# EAGLE board GECBalloonMCUFlightBoard_REV2.0_5-6-19 (EAGLE 7.6.0), part 1 of 2
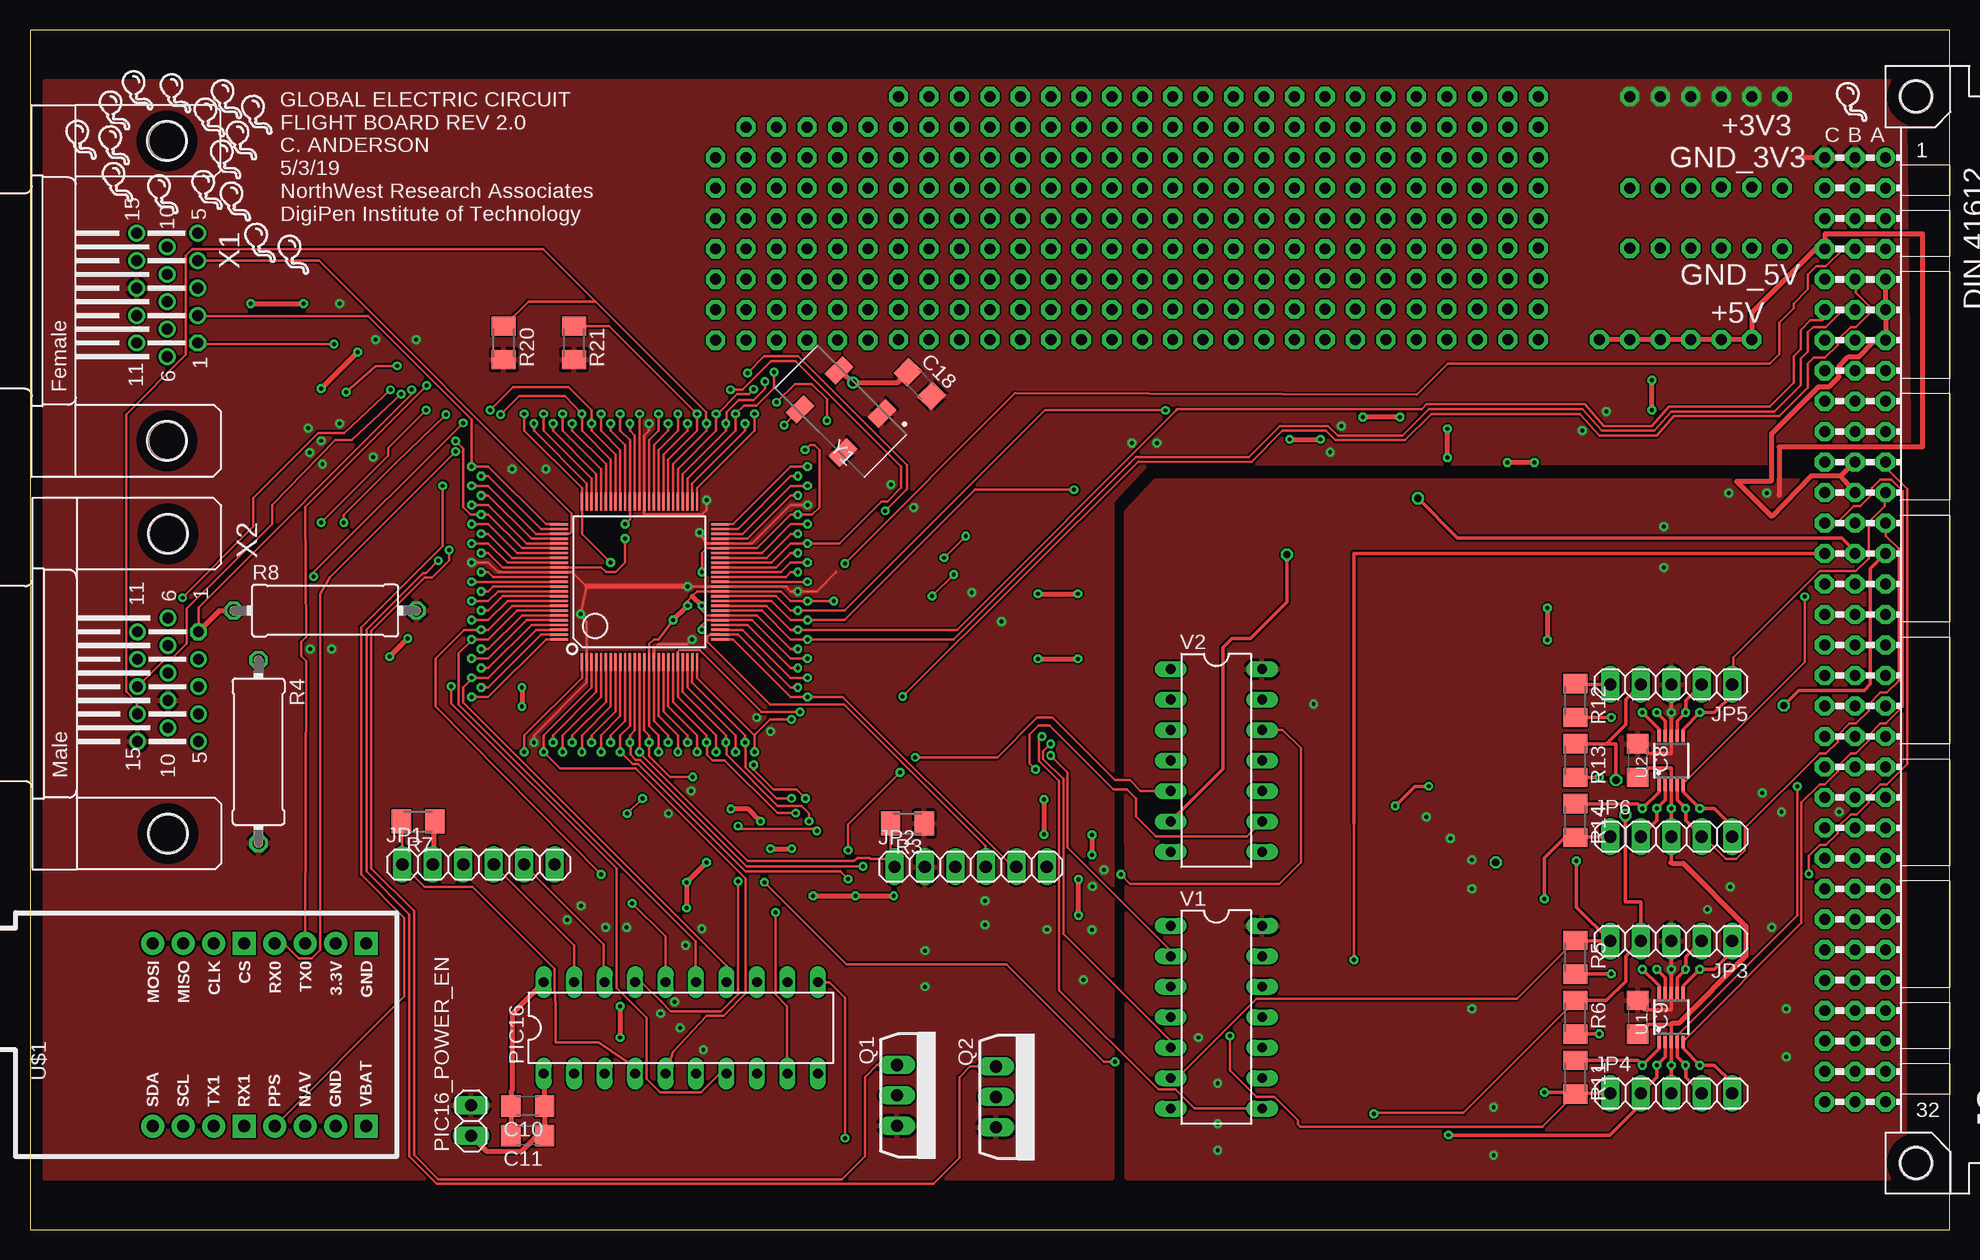
[diagram p2: board, top side]
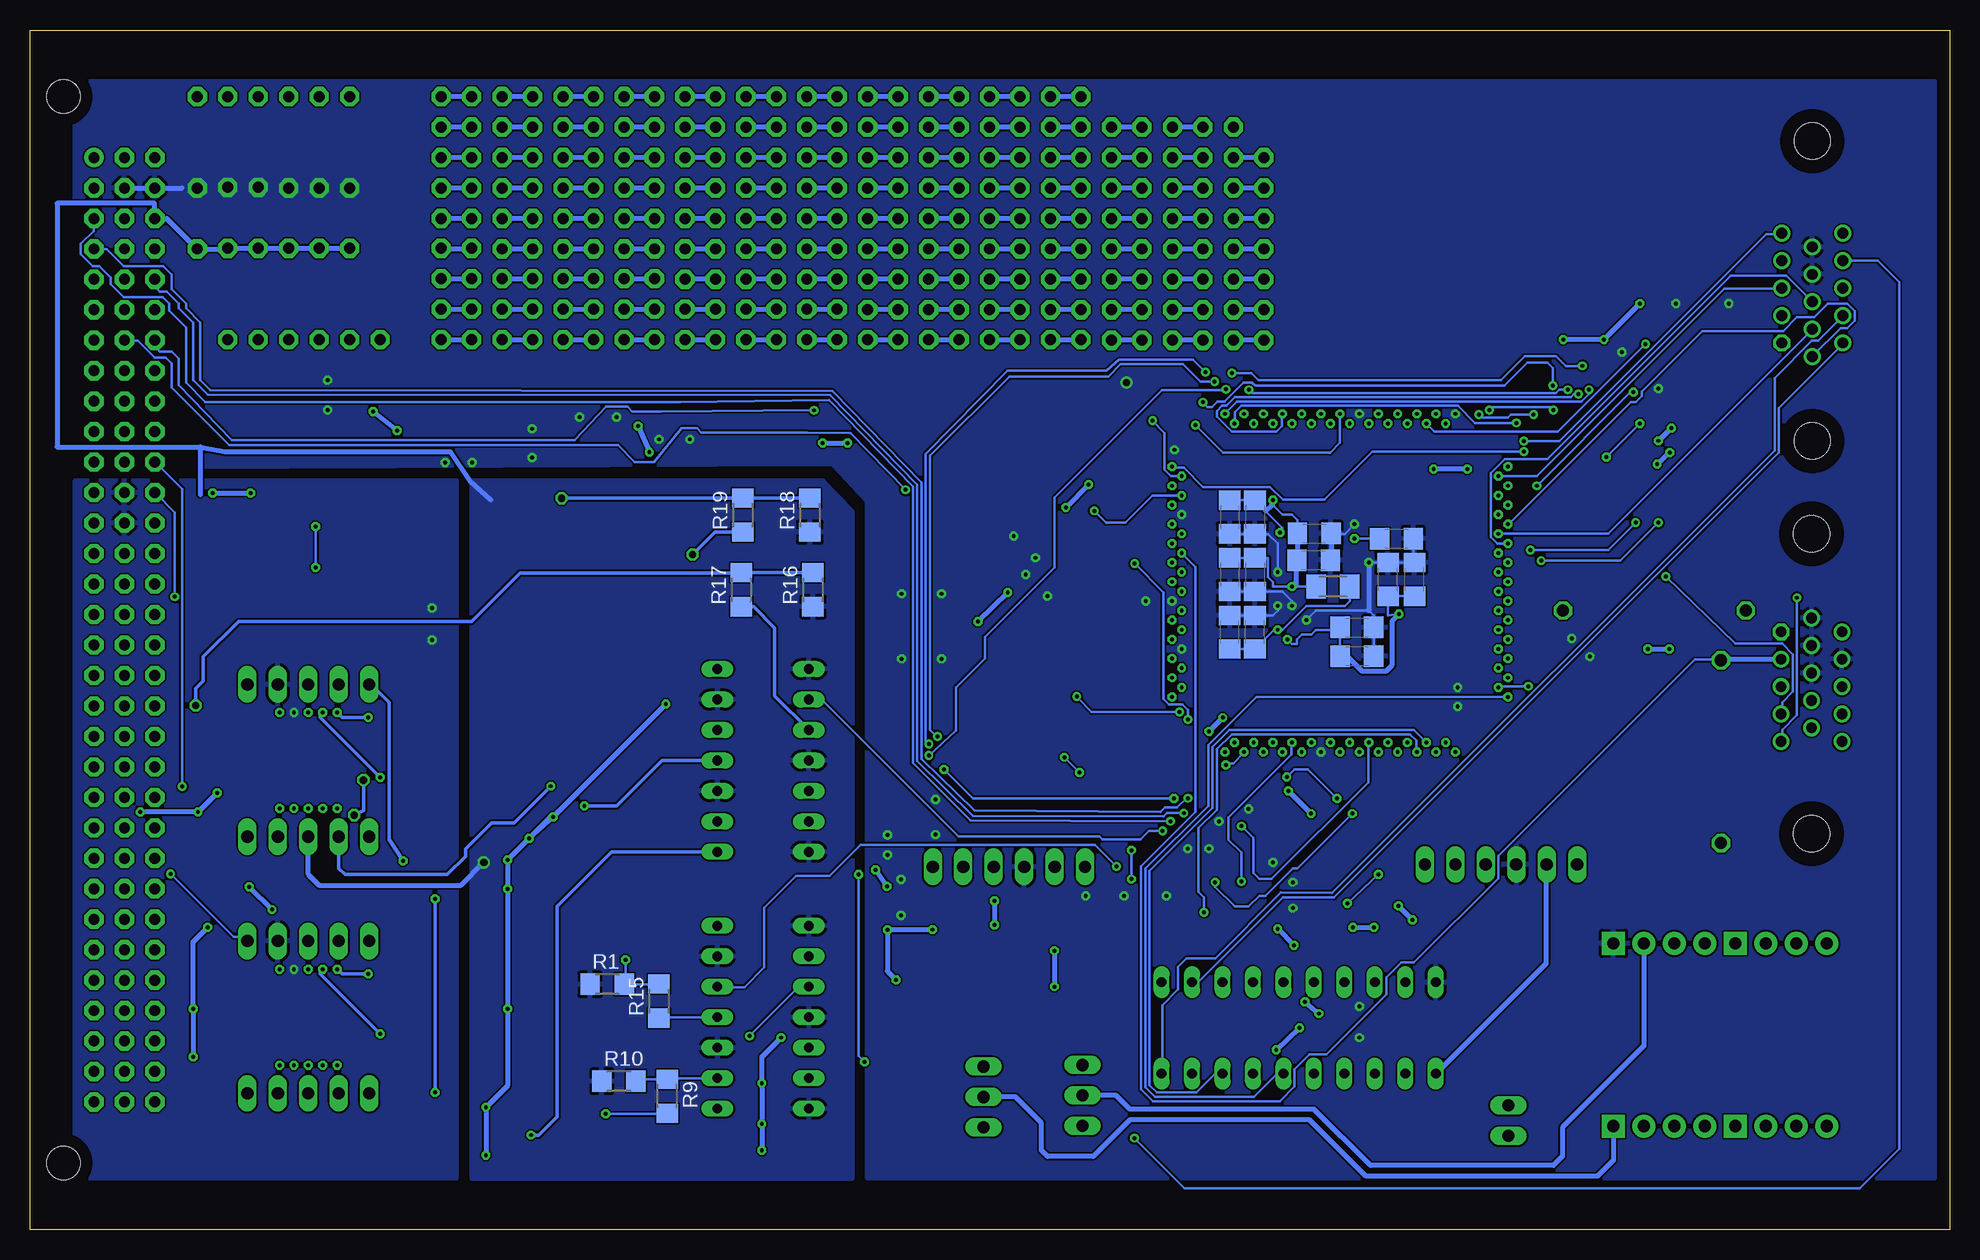
[diagram p3: board, bottom side, seen from below]

Size 160 x 100 mm. Coordinates in mm from the lower left corner, seen from the top.
Copper layers (1*16): Top 0.035mm / dielectric 1.5mm / Bottom 0.035mm
Design rules "default *": minimum track width 6mil, minimum drill 0.3mm, track to track 6mil, track to pad 6mil, pad to pad 6mil, via to via 6mil, smd to smd 6mil, copper to edge 40mil, drill to drill 6mil, minimum pad ring 10mil, minimum via ring 8mil, stop-mask expansion 6mil, vias tented up to drill 0mil, thermal gap 10mil
Net classes: 0 default: width 0.203 mm, drill 0.33 mm, clearance 0.152 mm; 1 power: width 0.406 mm, drill 0.33 mm, clearance 0.152 mm
tKeepout: area 0,97 to 160,100; area 0,0 to 160,3
bKeepout: area 0,0 to 160,3; area 0,97 to 160,100
vRestrict: area 0,0 to 160,3; area 0,97 to 160,100

## Footprints (pad centres in the part's own frame; a part is rotated, then mirrored left to right if it is on the bottom)
C1206 = smd 1.6 x 1.8: 1 -1.4,0; 2 1.4,0
TQFP100 = smd 0.2 x 1.5: 1 -4.8,-6.7; 2 -4.4,-6.7; 3 -4,-6.7; 4 -3.6,-6.7; 5 -3.2,-6.7; 6 -2.8,-6.7; 7 -2.4,-6.7; 8 -2,-6.7; 9 -1.6,-6.7; 10 -1.2,-6.7; 11 -0.8,-6.7; 12 -0.4,-6.7; 13 0,-6.7; 14 0.4,-6.7; 15 0.8,-6.7; 16 1.2,-6.7; 17 1.6,-6.7; 18 2,-6.7; 19 2.4,-6.7; 20 2.8,-6.7; 21 3.2,-6.7; 22 3.6,-6.7; 23 4,-6.7; 24 4.4,-6.7; 25 4.8,-6.7; 51 4.8,6.7; 52 4.4,6.7; 53 4,6.7; 54 3.6,6.7; 55 3.2,6.7; 56 2.8,6.7; 57 2.4,6.7; 58 2,6.7; 59 1.6,6.7; 60 1.2,6.7; 61 0.8,6.7; 62 0.4,6.7; 63 0,6.7; 64 -0.4,6.7; 65 -0.8,6.7; 66 -1.2,6.7; 67 -1.6,6.7; 68 -2,6.7; 69 -2.4,6.7; 70 -2.8,6.7; 71 -3.2,6.7; 72 -3.6,6.7; 73 -4,6.7; 74 -4.4,6.7; 75 -4.8,6.7 | smd 1.5 x 0.2: 26 6.7,-4.8; 27 6.7,-4.4; 28 6.7,-4; 29 6.7,-3.6; 30 6.7,-3.2; 31 6.7,-2.8; 32 6.7,-2.4; 33 6.7,-2; 34 6.7,-1.6; 35 6.7,-1.2; 36 6.7,-0.8; 37 6.7,-0.4; 38 6.7,0; 39 6.7,0.4; 40 6.7,0.8; 41 6.7,1.2; 42 6.7,1.6; 43 6.7,2; 44 6.7,2.4; 45 6.7,2.8; 46 6.7,3.2; 47 6.7,3.6; 48 6.7,4; 49 6.7,4.4; 50 6.7,4.8; 76 -6.7,4.8; 77 -6.7,4.4; 78 -6.7,4; 79 -6.7,3.6; 80 -6.7,3.2; 81 -6.7,2.8; 82 -6.7,2.4; 83 -6.7,2; 84 -6.7,1.6; 85 -6.7,1.2; 86 -6.7,0.8; 87 -6.7,0.4; 88 -6.7,0; 89 -6.7,-0.4; 90 -6.7,-0.8; 91 -6.7,-1.2; 92 -6.7,-1.6; 93 -6.7,-2; 94 -6.7,-2.4; 95 -6.7,-2.8; 96 -6.7,-3.2; 97 -6.7,-3.6; 98 -6.7,-4; 99 -6.7,-4.4; 100 -6.7,-4.8
VG96KB = drill 0.914 pad 1.6: A1 154.666,39.37 | drill 0.914 pad 1.6 octagon: A2 154.666,36.83; A3 154.666,34.29; A4 154.666,31.75; A5 154.666,29.21; A6 154.666,26.67; A7 154.666,24.13; A8 154.666,21.59; A9 154.666,19.05; A10 154.666,16.51; A11 154.666,13.97; A12 154.666,11.43; A13 154.666,8.89; A14 154.666,6.35; A15 154.666,3.81; A16 154.666,1.27; A17 154.666,-1.27; A18 154.666,-3.81; A19 154.666,-6.35; A20 154.666,-8.89; A21 154.666,-11.43; A22 154.666,-13.97; A23 154.666,-16.51; A24 154.666,-19.05; A25 154.666,-21.59; A26 154.666,-24.13; A27 154.666,-26.67; A28 154.666,-29.21; A29 154.666,-31.75; A30 154.666,-34.29; A31 154.666,-36.83; A32 154.666,-39.37; B1 152.126,39.37; B2 152.126,36.83; B3 152.126,34.29; B4 152.126,31.75; B5 152.126,29.21; B6 152.126,26.67; B7 152.126,24.13; B8 152.126,21.59; B9 152.126,19.05; B10 152.126,16.51; B11 152.126,13.97; B12 152.126,11.43; B13 152.126,8.89; B14 152.126,6.35; B15 152.126,3.81; B16 152.126,1.27; B17 152.126,-1.27; B18 152.126,-3.81; B19 152.126,-6.35; B20 152.126,-8.89; B21 152.126,-11.43; B22 152.126,-13.97; B23 152.126,-16.51; B24 152.126,-19.05; B25 152.126,-21.59; B26 152.126,-24.13; B27 152.126,-26.67; B28 152.126,-29.21; B29 152.126,-31.75; B30 152.126,-34.29; B31 152.126,-36.83; B32 152.126,-39.37; C1 149.586,39.37; C2 149.586,36.83; C3 149.586,34.29; C4 149.586,31.75; C5 149.586,29.21; C6 149.586,26.67; C7 149.586,24.13; C8 149.586,21.59; C9 149.586,19.05; C10 149.586,16.51; C11 149.586,13.97; C12 149.586,11.43; C13 149.586,8.89; C14 149.586,6.35; C15 149.586,3.81; C16 149.586,1.27; C17 149.586,-1.27; C18 149.586,-3.81; C19 149.586,-6.35; C20 149.586,-8.89; C21 149.586,-11.43; C22 149.586,-13.97; C23 149.586,-16.51; C24 149.586,-19.05; C25 149.586,-21.59; C26 149.586,-24.13; C27 149.586,-26.67; C28 149.586,-29.21; C29 149.586,-31.75; C30 149.586,-34.29; C31 149.586,-36.83; C32 149.586,-39.37 | hole 2.794: 157.206,44.45; 157.206,-44.45
1X06 = drill 1.016 long: 1 -6.35,0; 2 -3.81,0; 3 -1.27,0; 4 1.27,0; 5 3.81,0; 6 6.35,0
1X05 = drill 1.016 long: 1 -5.08,0; 2 -2.54,0; 3 0,0; 4 2.54,0; 5 5.08,0
DIL20 = drill 0.813 long: 1 -11.43,-3.81; 2 -8.89,-3.81; 3 -6.35,-3.81; 4 -3.81,-3.81; 5 -1.27,-3.81; 6 1.27,-3.81; 7 3.81,-3.81; 8 6.35,-3.81; 9 8.89,-3.81; 10 11.43,-3.81; 11 11.43,3.81; 12 8.89,3.81; 13 6.35,3.81; 14 3.81,3.81; 15 1.27,3.81; 16 -1.27,3.81; 17 -3.81,3.81; 18 -6.35,3.81; 19 -8.89,3.81; 20 -11.43,3.81
1X02 = drill 1.016 long: 1 -1.27,0; 2 1.27,0
TO262-V = drill 1.016 long: 1 -2.54,0; 2 0,0; 3 2.54,0
R1206 = smd 1.6 x 1.803: 1 -1.422,0; 2 1.422,0
M1206 = smd 1.6 x 2: 1 -1.4,0; 2 1.4,0
0414/15 = drill 1.016 octagon: 1 -7.62,0; 2 7.62,0
MSOP10 = smd 0.3 x 1: 1 -1,-2.05; 2 -0.5,-2.05; 3 0,-2.05; 4 0.5,-2.05; 5 1,-2.05; 6 1,2.05; 7 0.5,2.05; 8 0,2.05; 9 -0.5,2.05; 10 -1,2.05
SPARKFUN_BOARD = drill 1.016 pad 1.93 square: 1 7.62,-8.89; 5 7.62,1.27; 12 -7.62,1.27; 16 -7.62,-8.89 | drill 1.016 pad 1.93: 2 7.62,-6.35; 3 7.62,-3.81; 4 7.62,-1.27; 6 7.62,3.81; 7 7.62,6.35; 8 7.62,8.89; 9 -7.62,8.89; 10 -7.62,6.35; 11 -7.62,3.81; 13 -7.62,-1.27; 14 -7.62,-3.81; 15 -7.62,-6.35
DIL14 = drill 0.813 long: 1 -7.62,-3.81; 2 -5.08,-3.81; 3 -2.54,-3.81; 4 0,-3.81; 5 2.54,-3.81; 6 5.08,-3.81; 7 7.62,-3.81; 8 7.62,3.81; 9 5.08,3.81; 10 2.54,3.81; 11 0,3.81; 12 -2.54,3.81; 13 -5.08,3.81; 14 -7.62,3.81
HDF15H = drill 0.9 octagon: 1 4.329,2.54 | drill 0.9: 2 2.043,2.54; 3 -0.243,2.54; 4 -2.529,2.54; 5 -4.815,2.54; 6 5.472,0; 7 3.186,0; 8 0.9,0; 9 -1.386,0; 10 -3.672,0; 11 4.329,-2.54; 12 2.043,-2.54; 13 -0.243,-2.54; 14 -2.529,-2.54; 15 -4.815,-2.54 | hole 3: -12.5,0; 12.5,0
MALE_PACKAGE = drill 0.9 octagon: 1 -4.329,2.54 | drill 0.9: 2 -2.043,2.54; 3 0.243,2.54; 4 2.529,2.54; 5 4.815,2.54; 6 -5.472,0; 7 -3.186,0; 8 -0.9,0; 9 1.386,0; 10 3.672,0; 11 -4.329,-2.54; 12 -2.043,-2.54; 13 0.243,-2.54; 14 2.529,-2.54; 15 4.815,-2.54 | hole 3: 12.5,0; -12.5,0
SG-636 = smd 1.3 x 2.1: 1 -2.54,-2.3; 2 2.54,-2.3; 3 2.54,2.3; 4 -2.54,2.3

## Placement (x,y rotation side)
C1  0.1uF  [C1206]  44.6,54.2 90 bottom
C2  0.1uF  [C1206]  49.4,47.8 0 bottom
C3  0.1uF  [C1206]  60,49.8 90 bottom
C4  0.1uF  [C1206]  60,59.4 270 bottom
C5  0.1uF  [C1206]  60,54.6 270 bottom
C6  0.1uF  [C1206]  52.95,58.03 0 bottom
C7  0.1uF  [C1206]  46.1,57.6 0 bottom
C8  0.1uF  [C1206]  134,39.1 270 top
C9  0.1uF  [C1206]  134,17.7 270 top
C10  0.1uF  [C1206]  41.49,10.29 180 top
C11  0.01uF  [C1206]  41.49,7.84 180 top
C12  0.01uF  [C1206]  57.9,59.4 270 bottom
C13  0.01uF  [C1206]  49.4,50.2 0 bottom
C14  0.01uF  [C1206]  57.9,54.6 270 bottom
C15  0.01uF  [C1206]  46.8,54.2 90 bottom
C16  0.01uF  [C1206]  53,55.8 0 bottom
C17  0.01uF  [C1206]  57.9,49.8 90 bottom
C18  0.1uF  [C1206]  74.17,70.48 315 top
IC1  PIC32MX360F512L  [TQFP100]  50.8,54 0 top
J2  [VG96KB]  0,50 0 top
JP1  [1X06]  37.39,30.43 0 top
JP2  [1X06]  78.4,30.24 0 top
JP3  [1X05]  136.8,24.05 180 top
JP4  [1X05]  136.8,11.35 0 top
JP5  [1X05]  136.8,45.45 180 top
JP6  [1X05]  136.8,32.75 0 top
PIC16  pic16f689  [DIL20]  54.25,16.81 0 top
PIC16_POWER_EN  [1X02]  36.77,9.08 90 top
Q1  IRF3704L-V  [TO262-V]  72.26,11.18 270 top
Q2  IRF3704L-V  [TO262-V]  80.52,11.05 270 top
R1  680  [R1206]  111.89,20.45 0 bottom
R2  10  [M1206]  51.4,53.6 0 bottom
R3  10k  [M1206]  73.14,33.85 180 top
R4  1k  [0414/15]  19.05,39.84 270 top
R5  50  [M1206]  128.8,22.7 270 top
R6  50  [M1206]  128.8,17.7 270 top
R7  10k  [M1206]  32.35,34.01 180 top
R8  1k  [0414/15]  24.6,51.6 0 top
R9  510  [R1206]  106.89,11.1 270 bottom
R10  680  [R1206]  110.92,12.36 0 bottom
R11  50  [M1206]  128.8,12.7 270 top
R12  50  [M1206]  128.8,44.1 270 top
R13  50  [M1206]  128.8,39.1 270 top
R14  50  [M1206]  128.8,34.1 270 top
R15  510  [R1206]  107.57,19.05 90 bottom
R16  680  [R1206]  94.74,53.34 90 bottom
R17  510  [R1206]  100.71,53.34 90 bottom
R18  680  [R1206]  95,59.56 90 bottom
R19  510  [R1206]  100.58,59.56 90 bottom
R20  10k  [M1206]  39.5,73.91 270 top
R21  10k  [M1206]  45.34,73.91 270 top
U1  ADS1118  [MSOP10]  136.8,17.7 0 top
U2  ADS1118  [MSOP10]  136.8,39.1 0 top
U$1  SPARKFUN_VENUS_GPS_BREAKOUT  [SPARKFUN_BOARD]  19.12,16.24 90 top
U$2  [BALLOON]  18.53,93.36 0 top
U$3  [BALLOON]  21.57,81.69 0 top
U$4  [BALLOON]  3.88,91.28 0 top
U$5  [BALLOON]  16.74,86.13 0 top
U$6  [BALLOON]  10.7,86.74 0 top
U$7  [BALLOON]  6.63,90.81 0 top
U$8  [BALLOON]  6.67,93.71 0 top
U$9  [BALLOON]  8.58,95.4 0 top
U$10  [BALLOON]  14.38,87.09 0 top
U$11  [BALLOON]  6.91,87.75 0 top
U$12  [BALLOON]  18.8,82.69 0 top
U$14  [BALLOON]  17.24,91.21 0 top
U$15  [BALLOON]  14.57,93.13 0 top
U$16  [BALLOON]  16,94.66 0 top
U$17  [BALLOON]  11.74,95.15 0 top
U$19  [BALLOON]  15.93,89.63 0 top
U$21  [BALLOON]  151.47,94.42 0 top
V1  74125N  [DIL14]  98.89,17.7 270 top
V2  74125N  [DIL14]  98.89,39.1 270 top
X1  [HDF15H]  11.43,78.24 270 top
X2  MALE_VGA  [MALE_PACKAGE]  11.5,45.5 270 top
Y1  SG-636PCW_50.0000MC3__ROHS  [SG-636]  67.6,68.2 135 top

## Tracks (layer width: path | path; a pad name or v marks a point on that pad's centre or on a via)
!MCLR  (via drill 0.33)
  Top 0.203: IC1.13 v50.8,39.8 50.85,39.78 50.85,39.7 59.82,30.73 68.71,30.73 68.96,30.99 69.98,30.99 70.08,30.89 71.65,30.89 JP2.1 72.01,30.26 71.74,30.53 71.74,33.82 R3.2
!SS1  (via drill 0.33)
  Top 0.203: v58.8,39.8 58.8,41.2 54.8,45.2 IC1.23 54.8,47.4 | v60.33,38.73 60.33,38.35 61.98,36.7 63.88,36.7 v64.64,35.94 | v83.82,38.35 83.31,38.86 83.31,41.27 84.07,42.04 84.96,42.04 90.3,36.7 91.44,36.7 92.2,35.94 92.2,34.42 93.85,32.77 101.45,32.77 V2.9
  Bottom 0.203: v58.8,39.8 58.8,39.75 59.69,38.86 60.2,38.86 v60.33,38.73 | v64.64,35.94 81.41,35.94 v83.82,38.35
!SS1_5V  (via drill 0.33)
  Top 0.305: U1.2 136.3,14.41 v135.59,13.7 135.59,12.68 JP4.2 134.26,10.44 131.7,7.87 v118.24,7.87
  Bottom 0.305: v118.24,7.87 117.6,7.87 116.08,9.4 116.08,26.92 111.51,31.5 102.72,31.5 V2.8
!SS2  (via drill 0.33)
  Top 0.203: V2.12 104.41,41.64 105.92,40.13 105.92,30.61 104.14,28.83 91.69,28.83 v90.93,29.59 | v90.42,13.97 89.53,13.97 81.41,22.1 68.07,22.1 v61.21,28.96 | v49.78,34.67 v51.05,35.94 | v55.24,37.72 53.34,37.72 51.6,39.46 v51.6,40.6 51.6,41.2 51.2,41.6 IC1.14 51.2,47.4
  Bottom 0.203: v90.93,29.59 90.93,14.48 v90.42,13.97 | v61.21,28.96 61.21,28.57 59.56,26.92 58.42,26.92 57.53,27.81 57.02,27.81 54.74,30.1 54.36,30.1 v49.78,34.67 | v51.05,35.94 53.47,38.35 54.61,38.35 v55.24,37.72
!SS2_5V  (via drill 0.33)
  Top 0.305: U2.2 136.3,35.81 v135.59,35.1 135.59,34.08 JP6.2 | v116.59,36.96 115.44,36.96 v113.79,35.31
  Bottom 0.305: JP6.2 134.26,30.12 133.73,29.59 125.22,29.59 123.7,31.11 123.7,31.75 121.54,33.91 119.63,33.91 v116.59,36.96 | v113.79,35.31 111.12,35.31 107.31,39.12 102.72,39.12 V2.11
+3V3  (via drill 0.33, 0.91 pad 1.6)
  Top 0.203: v54.8,53.6 IC1.37 63,53.6 63.4,53.2 v64,53.2 65.6,53.2 67.2,54.8 | v55.8,58.1 56.4,57.2 IC1.46 60.2,57.2 63.4,60.4 v64.8,60.4 | IC1.16 52,48.4 52.4,48.8 54.8,48.8 v55.2,49.2 | v56.4,60.8 56.4,60 56,59.6 51.2,59.6 IC1.62 51.2,66.2 51.6,66.6 v51.6,67.2 | v36.8,55.6 38.2,55.6 39,54.8 IC1.86 45.2,54.8 46.4,53.6 v45.9,51.3 46.4,50.6 IC1.2 46.4,45.6 42,41.2 v42,40.6
  Top 0.406: v54.8,53.6 54.72,53.65 46.45,53.65 46.4,53.6 | J2.B1 J2.C1 147.32,89.37
  Bottom 0.203: R2.1 v54.8,53.6 56.4,53.6 56.4,54 56.8,54.4 56.8,56 C14.1 | v55.2,49.2 54.8,48.8 54.4,48.8 54.4,49.2 54,49.6 53.2,49.6 52.8,50 51,50 C13.1 C2.1 | C14.1 57.6,56 | C14.1 57.5,55.6 57.2,55.6 | C5.1 C14.1 | C4.1 C12.1 57,59.9 55.6,58.5 v55.8,58.1 | C1.1 C15.1 46.8,51.2 v45.9,51.3 | C6.1 54.35,59.15 54.8,59.6 55.6,59.6 56.4,60.4 v56.4,60.8 | v25.8,67.2 v28.6,64.4
  Bottom 0.406: C6.1 54.36,58 54.36,55.87 C16.1 54.45,55.6 54.45,53.65 v54.8,53.6 | 57,59.9 56.5,60.4 56.4,60.4 | C2.1 50.72,47.78 50.19,47.78 48.94,46.53 46.99,46.53 46.45,47.07 46.45,50.71 v45.9,51.3 | v40.2,63.4 v43,63.4 | v74.61,23.25 v74.61,20.25 | v79.6,27.4 v79.6,25.4 | v25.8,77.2 v28.8,74.2 v32.2,74.2 | v129.4,66.6 v131.4,68.2 | v109.33,66.97 v108.38,64.8 | v93.92,65.58 v91.85,65.58 | v78.5,53.1 v80.97,50.67 | v89.53,29.98 v88.58,28.6 | v87.8,20.8 88.53,21.52 v88.53,24.98 88.5,25 v84.78,25 | v25.15,48.4 v23.35,48.4 | v49.73,25.18 v47.98,25.2 | v45.92,26.98 v44.77,25.8 | v53.73,18.98 v52.58,18 | v56.12,14.97 v54.17,16.8 | v56,25.07 v54.65,23.7 | v23.18,66.8 v24.27,65.75 | v23.32,64.78 v24.38,63.8 | v53.21,34.67 v55.12,36.58 | v71.75,62.1 v73.66,60.2 | v60.58,42.67 v61.72,41.53
  other vias: 135.89,94.45 133.35,94.45 140.97,94.45 146.05,94.45 138.43,94.45 143.51,94.45
  pour Top: 1.27,95.72 156.21,95.72 156.61,63.91 93,63.8 93.06,63.8 90.17,60.71 90.17,4.28 1.27,4.28
+3V3_PIC_ANALOG  (via drill 0.33)
  Top 0.203: v56,50 56,50.4 56.4,50.8 IC1.30 60.2,50.8 63.4,47.6 v64.8,47.6
  Bottom 0.203: C3.1 C17.1 56.3,50 v56,50 55.6,50 53.6,52 50.4,52 50,52.4 R2.2
+5V  (via drill 0.33, 0.91 pad 1.6)
  Top 0.305: U1.8 v136.8,21.7 | U2.8 v136.8,43.1 | v136.8,43.1 JP5.3 | v136.8,21.7 136.8,24 | v136.8,43.1 136.8,39.7 134.8,39.7 C8.1 | v136.8,21.7 136.8,18.3 134.8,18.3 arc-90 C9.1
  Top 0.406: J2.C4 149.61,81.75 | 145.8,61.2 145.8,61.26 145.8,65.24 157.73,65.24 157.73,83.02 149.61,83.02 149.61,81.77 J2.C4 | JP3.3 136.8,24 | v145.2,25.2 145.11,25.2 | J2.C4 148.81,81.75 143.51,76.45 v143.51,74.18 v140.97,74.18 v138.43,74.18 v135.89,74.18 v133.35,74.18 v130.81,74.18
  Bottom 0.203: v136.2,58.6 v136.2,55.2
  Bottom 0.406: v116.4,34.4 v118.4,32.6 | v107,43.8 v116.4,34.4 | v116.4,34.4 116.6,34.4 v118.4,32.6 | v118.4,32.6 v120.2,30.8 v120.2,28.4 v120.2,18.4 120.2,12 v122,10.2 v122,6.2 | v99,6.6 v99,8.8 v99,12.2 99,14.4 v97.4,16 | v146.4,14.4 v146.4,18.4 146.4,24 v145.2,25.2 | v144.4,36.4 v146,34.8 v150.8,34.8 | v144.76,61.39 v141.62,61.39 | v141.73,28.57 v139.83,26.67
  pour Top: 93.84,62.44 156.21,62.44 156.21,4.28 91.44,4.28 91.4,59.8
ADC1_DIN  (via drill 0.33)
  Top 0.203: V1.6 95.12,12.66 95.66,12.66 102.23,19.24 123.93,19.24 128.73,24.04 R5.1
  Top 0.305: R5.1 128.85,24.05 JP3.5 128.91,26.86 v128.91,30.73 | R12.1 128.85,45.45 JP5.5
  Bottom 0.305: JP5.5 131.56,45.45 130.05,43.94 130.05,32.51 v128.91,30.73
ADC1_DIVIDED
  Bottom 0.203: V1.9 106.79,12.62 | R9.1 109.33,12.52 R10.2
  Bottom 0.305: R9.1 106.79,12.62
ADC1_DOUT  (via drill 0.33, 0.6)
  Top 0.203: R6.1 128.73,18.97 119.48,9.73 112.09,9.73 v112.01,9.65
  Top 0.305: R6.1 131.4,19.1 133,20.7 133,22.79 JP3.4 134.26,27.3 132.97,27.3 v132.97,34.54 | JP5.4 133,44.19 133,42.1 131.4,40.5 | 131.4,40.5 R13.1 | 131.4,40.5 132.21,40.5 v132.21,37.47
  Bottom 0.203: 106.95,9.73 R9.2 106.92,9.65 v112.01,9.65
  Bottom 0.305: v132.21,37.47 132.21,34.92 v132.97,34.54
ADC1_SCK  (via drill 0.33)
  Top 0.203: v100.01,16.13 100.01,13.28 102.23,11.06 103.75,11.06 105.7,9.11 105.7,8.75 105.88,8.57 126.06,8.57 128.73,11.24 R11.2 | 128.73,32.58 R14.2
  Top 0.305: JP4.1 128.85,11.35 R11.2 128.67,11.43 v126.24,11.43 | 128.8,32.75 R14.2 128.85,32.75 JP6.1 | 128.73,32.58 127.83,32.58 126.24,30.99 v126.24,27.56
  Bottom 0.203: v100.01,16.13 95.92,20.22 95.12,20.22 V1.3
  Bottom 0.305: v126.24,27.56 v126.24,11.43
BALLA1  (via drill 0.33)
  Top 0.203: IC1.77 42.6,58.4 38.2,62.8 v37.6,62.8
  Bottom 0.203: X1.3 14.05,78.45 18.76,78.45 34.4,62.8 37.52,62.8 v37.6,62.8
BALLA2  (via drill 0.33)
  Top 0.203: v36.8,62 38.2,62 42.2,58 IC1.78 44.18,58 44.98,58 45.16,58.18 45.16,59.69 24.09,80.76 14.05,80.76 X1.4
BALLA3  (via drill 0.33)
  Top 0.203: IC1.81 41,56.8 38.2,59.6 v37.6,59.6 37.52,59.6 36.72,59.6 36.09,60.22 36.09,65.11 v35.47,65.73
  Bottom 0.203: v35.47,65.73 32.54,65.73 15.29,82.98 14.05,82.98 X1.5
BALLA4  (via drill 0.33)
  Top 0.203: IC1.82 40.6,56.4 38.2,58.8 v36.8,58.8
  Bottom 0.203: X1.6 11.38,72.85 9.07,75.16 8.53,75.16 7.91,75.78 7.91,76.58 8.53,77.2 10.13,77.2 11.29,76.05 12.71,76.05 13.87,74.89 20.62,74.89 25.65,69.86 25.65,69.47 26.16,68.96 26.56,68.96 36.72,58.8 v36.8,58.8
BALLC1  (via drill 0.33)
  Top 0.203: IC1.83 40.2,56 38.2,58 v37.6,58
  Bottom 0.203: X1.7 11.47,74.98 28.45,58 37.52,58 v37.6,58
BALLC2  (via drill 0.33)
  Top 0.203: v36.8,57.2 38.2,57.2 39.8,55.6 IC1.84
  Bottom 0.203: X1.8 11.47,77.38 13.6,79.52 18.22,79.52 33.52,64.22 37.07,64.22 38.23,63.07 38.23,57.73 37.69,57.2 v36.8,57.2
BALLS1  (via drill 0.33)
  Top 0.203: 47.2,60.4 IC1.72 47.2,63 43.6,66.6 v43.6,67.2 | v25.34,73.83 14.05,73.83 X1.1
  Bottom 0.203: v25.34,73.83 32.63,66.53 42.94,66.53 43.56,67.16 v43.6,67.2
BALLS2  (via drill 0.33)
  Top 0.203: IC1.76 43,58.8 38.2,63.6 v36.8,63.6 36.8,63.69 36.8,67.51 28.18,76.14 14.05,76.14 X1.2
CHARGE_PROBE_0  (via drill 0.6)
  Top 0.305: J2.A14 154.65,56.35 153.42,55.12 153.42,45.47 152.91,44.96 147.45,44.96 v146.18,43.69
  Bottom 0.305: R16.2 R17.2 100.74,54.74 119.13,54.74 123.19,50.67 142.62,50.67 145.54,47.75 145.54,45.72 146.18,45.09 v146.18,43.69
CHARGE_PROBE_1  (via drill 0.6)
  Top 0.305: J2.B14 152.13,56.53 151,57.66 119,57.66 v115.7,60.96
  Bottom 0.305: v115.7,60.96 100.61,60.96 R19.2 R18.2
CHRG_PRB_0_5V
  Bottom 0.305: R17.1 99.67,51.92 97.92,50.16 97.92,44.48 V2.3
CHRG_PRB_1_5V  (via drill 0.6)
  Top 0.305: v104.78,56.26 104.78,52.32 101.73,49.28 100.2,49.28 99.44,48.51 99.44,38.38 V2.6
  Bottom 0.305: R19.1 102.89,58.14 v104.78,56.26
COND_EN_5V
  Bottom 0.203: V1.11 107.5,17.7 R15.1
CONDUCTIVITY_ENABLE  (via drill 0.33)
  Top 0.203: 110.36,33.91 v110.36,22.48
  Top 0.305: J2.C14 110.36,56.35 110.36,33.91
  Bottom 0.203: R15.2 107.59,20.45 R1.2 110.36,20.55 v110.36,22.48
EXT_TEMP  (via drill 0.33)
  Top 0.203: IC1.41 62.2,55.2 63.4,56.4 v64,56.4
  Bottom 0.203: X2.2 14.05,47.51 21.25,47.51 37.6,31.15 37.6,29.29 44.63,22.26 45.7,22.26 46.94,21.02 46.94,19.6 51.92,14.62 53.34,14.62 54.59,13.37 54.59,11.95 55.83,10.71 66.41,10.71 67.39,11.68 67.39,30.26 62.85,34.8 62.85,55.24 63.92,56.31 v64,56.4
  Bottom 0.406: 14.05,47.51 19.05,47.51 R4.1
GND  (via drill 0.33)
  Top 0.305: U2.7 137.3,42.4 v138,43.1 138,44.1 JP5.2 | U1.7 137.3,21 v138,21.7 138,22.71 JP3.2
  Top 0.406: J2.A5 154.69,79.16 154.69,76.85 J2.A6 154.69,76.67 154.69,74.18 J2.A7 154.51,74 153.71,74 152.46,72.76 151.57,72.76 150.77,71.96 150.77,71.07 149.97,70.27 149.09,70.27 145.17,66.36 145.18,62.4 142.25,62.39 145.17,59.45 148.42,62.8 150.95,62.8 | 150.95,62.8 152.11,63.96 J2.B11 | J2.B12 150.95,62.8 | v126.49,51.82 v126.49,49.15
  pour Bottom: 124.46,62.44 124.46,4.28 156.21,4.28 156.21,62.44
GND_3V3  (via drill 0.33, 0.6, 0.91 pad 1.6)
  Top 0.203: v53.6,50.8 52.4,49.2 52,49.2 51.6,48.8 51.6,47.4 IC1.15 51.6,42 52.4,41.2 v52.4,39.8 | v48.4,55.6 46,58 IC1.75 46,61.8 41.2,66.6 v41.2,68 | v56,52 56,51.6 56.4,51.2 IC1.31 60.6,51.2 63.4,48.4 v64,48.4 | v54.8,52 54.8,52.4 55.2,52.8 55.6,53.2 IC1.36 62.6,53.2 63.4,52.4 v64.8,52.4 v67,52.4 | v49.6,58.8 50,59.2 IC1.65 50,65.8 49.2,66.6 v49.2,68 | v56,54.8 56,56.4 56.4,56.8 IC1.45 60.6,56.8 63.4,59.6 v64,59.6 65.2,59.6 65.8,60.2 65.8,65 65.4,65.4 65,65.4 v64.6,65 | v76.2,56 v78,57.8 | v75.2,52.8 v77,54.6
  Top 0.406: C11.2 C10.2 40.09,11.48 40.18,11.6 40.18,18 42.76,20.57 PIC16.20 | 55.2,52.8 55.97,52.05 v56,52 | v54.8,52 54.72,51.96 53.56,50.8 v53.6,50.8 | v41,45.2 v41,43.6 | v49.2,18.6 v49.2,16 | v84.02,53 v87.35,53 | v84.02,47.58 v87.35,47.58 | v87.4,26.2 v87.4,29.2 | v72,27.8 v68.8,27.8 68.79,27.81 v65.28,27.81 | v18.4,77.2 v22.8,77.2 | v135.2,68.33 v135.2,70.8 | v114.2,67.72 v111.1,67.72 | v105,65.88 v107.58,65.88 | v125.4,63.95 v123.15,63.95 | v118.15,64.35 v118.15,66.75 | v84.52,35.85 v84.52,32.92 | Y1.2 v68.6,70.6 72.3,70.6 C18.1 | v88.52,32.89 v88.52,31.24 | v29.97,47.75 v31.5,49.28 | v54.74,26.8 v54.74,28.96 v56.39,30.61 | v27.3,73.15 v24.26,70.1 | v61.72,31.75 v63.5,31.75 | v60.9,34.04 59.88,35.05 v58.42,35.05
  Bottom 0.203: C3.2 C17.2 56.4,51.2 56,51.6 v56,52 | v53.6,50.8 52.8,51.6 48.4,51.6 48,51.2 C13.2 C2.2 | C5.2 C14.2 55.6,53.2 54.8,52.4 v54.8,52 | C4.2 C12.2 56.8,58 56,57.2 v56,54.8 | v48.4,55.6 C15.2 C1.2 44.7,55.7 C7.2 | C6.2 51.52,58 50.4,58 v49.6,58.8
  Bottom 0.406: C16.2 51.52,55.87 51.52,57.91 C6.2 | 48.4,51.6 48.41,51.69 48.41,55.51 v48.4,55.6 | J2.B2 J2.C2 147.32,86.83
  other vias: 146.05,86.83 143.51,86.88 140.97,86.88 138.43,86.83 135.89,86.83 133.35,86.83
  pour Bottom: 1.27,4.28 90.17,4.28 90.17,60.71 93.08,63.8 93.8,63.8 156.21,63.51 156.21,95.72 1.27,95.72
GND_5V  (via drill 0.33, 0.6, 0.91 pad 1.6)
  Top 0.305: U2.3 v136.8,35.1 JP6.3 136.8,30.9 arc-16 136.75,30.57 | U2.3 136.8,37.5 | C9.2 134.8,17.1 136.8,17.1 U1.3 v136.8,13.7 JP4.3 | U2.3 136.8,38.5 134.8,38.5 C8.2
  Top 0.406: 136.8,17.1 136.91,17.2 137.44,17.2 143.04,22.8 143.04,25.29 137.79,30.53 136.91,30.53 136.75,30.57
  Bottom 0.406: 145.8,65.24 157.73,65.24 157.73,85.56 149.61,85.56 149.61,84.29 J2.C3 148.59,84.29 v146.05,81.75 143.56,81.75 v143.51,81.8 v140.97,81.8 v138.43,81.8 v135.89,81.8 v133.35,81.8 | 145.8,65.24 145.8,61.26 | 145.8,65.24 145.6,65.16 143.73,64.82 124.95,64.82 123.3,62.38 121.59,60.84 | JP6.3 136.8,29.61 135.89,28.7 124.08,28.7 v122.17,30.61
  pour Bottom: 123.19,62.44 123.19,4.28 91.44,4.28 91.44,59.84 93.88,62.4 94,62.4
GPS_3V3_OUT
  Bottom 0.406: U$1.2 25.47,15.3 32.26,8.51 32.26,6.1 33.02,5.33 48.26,5.33 52.96,10.03 68.33,10.03 69.47,11.18 Q1.2
GPS_3V3_SGNL  (via drill 0.33)
  Top 0.203: 48.4,60.4 IC1.69 48.4,64.2 46,66.6 v46,68 44.6,69.47 40.77,69.47 v39.24,67.94 | v34.67,67.94 30.48,63.88 26.16,59.56 v26.16,58.93 | v34.92,56.64 34.92,55.75 33.53,54.36 32.89,54.36 28.45,49.91 28.45,30.1 32,26.54 32,6.22 34.04,4.19 67.69,4.19 69.6,6.1 69.6,12.7 70.61,13.72 Q1.1
  Bottom 0.203: v39.24,67.94 38.99,67.69 36.83,67.69 36.58,67.94 v34.67,67.94 | v26.16,58.93 28.45,56.64 v34.92,56.64
GPS_VBAT_OUT
  Bottom 0.406: U$1.16 28.01,5.77 29.34,4.45 48.64,4.45 53.34,9.14 68.33,9.14 71.37,6.1 75.18,6.1 75.69,6.6 75.69,8.89 77.85,11.05 Q2.2
GPS_VBAT_SGNL  (via drill 0.33)
  Top 0.203: 48.8,60.4 IC1.68 48.8,64.6 46.8,66.6 v46.8,67.2 46.8,68.33 44.9,70.23 40.26,70.23 v38.35,68.33 | v33.02,68.33 29.84,65.15 29.84,64.52 v24.26,58.93 | v34.04,55.75 33.02,54.74 32.77,54.74 28.07,50.04 28.07,29.84 31.62,26.29 31.62,6.1 33.91,3.81 75.31,3.81 77.47,5.97 77.47,12.7 78.36,13.59 Q2.1
  Bottom 0.203: v38.35,68.33 38.1,68.58 33.27,68.58 v33.02,68.33 | v24.26,58.93 27.43,55.75 v34.04,55.75
GPSPPS  (via drill 0.33)
  Top 0.203: IC1.47 59.8,57.6 63.4,61.2 v64,61.2 | v30.6,72 28.8,72 v26.35,69.8 | v34.4,62 34.4,57 27.6,50.2 27.6,29.6 31.2,26 31.2,19.43 U$1.13 | v59.8,71.4 61.2,72.8 64,72.8 73.09,63.71 73.09,61.71 v71.29,59.91
  Bottom 0.203: v59.8,71.4 58.2,71.4 57.6,70.8 37.4,70.8 35.4,72.8 32.8,72.8 32,72 v30.6,72 | v71.29,59.91 70.29,58.91 70.27,58.93 68.71,58.93 66.44,61.2 v64,61.2 | v26.35,69.8 26.4,69.85 26.54,69.85 v34.39,62 v34.4,62
I2C_SCL  (via drill 0.33)
  Top 0.203: IC1.57 53.2,64.2 55.6,66.6 v55.6,68 48.29,75.31 R21.1 | v30.94,69.65 26.8,65.8 25.43,65.8 20.2,60.4 20.2,58.8 13.07,51.78 13.07,48.84 11.91,47.69 11.38,47.69 8.98,45.29 X2.13
  Bottom 0.203: v30.94,69.65 31.29,69.65 31.56,69.38 59.56,69.38 60.27,68.67 60.63,68.67 61.07,68.22 61.07,67.78 59.83,66.53 56.1,66.53 55.65,66.98 55.65,67.96 v55.6,68
I2C_SDA  (via drill 0.33)
  Top 0.203: IC1.56 53.6,63.8 56.4,66.6 v56.4,67.2 56.36,67.25 56.36,68.14 47.14,77.36 | 47.14,77.36 42.76,81.74 13.51,81.74 12.98,81.2 12.98,72.94 8,67.96 8,44.84 8.89,43.95 8.89,42.98 X2.14 | R20.1 41.55,77.36 47.14,77.36
I_1_H  (via drill 0.33)
  Top 0.203: IC1.20 53.6,44 56.4,41.2 v56.4,40.6 56.45,40.58 56.45,39.56 56.9,39.12 57.91,39.12 62.32,34.71 v63.83,34.71
  Bottom 0.203: J2.C5 149.53,79.16 149.53,78.53 149.2,78.2 148.6,78.2 147.6,77.2 147.6,76.8 146.4,75.6 146.4,70.8 145.2,69.6 93.3,69.56 86.06,62.11 86.06,39.06 81.41,34.48 65.53,34.42 65.24,34.71 v63.83,34.71
I_1_L  (via drill 0.33)
  Top 0.203: v57.2,39.8 57.2,41.2 54,44.4 54,46.4 54.01,46.41 54.01,47.33 IC1.21 53.96,47.42 53.96,48.13 54.14,48.31 55.83,48.31 60.98,43.16 v64.19,43.16 | v72.75,44.42 92.39,64.02 101.8,64 104.4,66.6 108,66.6 108.8,65.8 114.6,65.8 116.8,68 129.2,68 130.8,66.2 135.6,66.2 137,67.8 145.8,67.8 148.2,70.2 148.2,72.2 148.67,72.67 149.62,72.67 150.69,73.74 150.69,74.18 151.75,75.25 152.2,75.25 153.26,76.31 153.26,77.03 152.2,78.09 152.2,79.16 J2.B5
  Bottom 0.203: v64.19,43.16 71.5,43.14 72.75,44.39 v72.75,44.42
I_2_H  (via drill 0.33)
  Top 0.203: IC1.33 61.4,52 63.4,50 v64,50 77.25,50 95.52,68.27 95.6,68.4 116,68.4 116.4,68.8 129.6,68.8 131.2,67 135.2,67 136.6,68.6 145,68.6 147,70.6 147,72.8 147.6,73.4 147.6,75 148.4,75.8 149.4,75.8 149.59,75.99 J2.C6
I_2_L  (via drill 0.33)
  Top 0.203: IC1.32 61,51.6 63.4,49.2 v64.8,49.2 64.9,49.2 76.99,49.2 91.64,63.85 91.65,63.85 92.2,64.4 101.6,64.4 104.2,67 108.2,67 109,66.2 114.4,66.2 116.6,68.4 129.4,68.4 131,66.6 135.4,66.6 136.8,68.2 145.4,68.2 147.6,70.4 147.6,72.6 148.2,73.2 148.2,74.8 148.65,75.25 149.71,75.25 151.13,76.67 J2.B6
I_3_H  (via drill 0.33)
  Top 0.203: IC1.35 62.2,52.8 63.4,51.6 v64,51.6 64.1,51.6 67.9,51.6 84.59,68.29 v94.66,68.29
  Bottom 0.203: v94.66,68.29 107.4,68.2 109.8,68.2 110.2,68.6 112,68.6 114.6,65.8 143.2,65.8 147.6,70.4 147.6,72.6 148.2,73.2 149.2,73.2 149.53,73.53 149.53,74.09 J2.C7
I_3_L  (via drill 0.33)
  Top 0.203: IC1.34 61.8,52.4 63.4,50.8 v64.8,50.8 67.9,50.8 78.77,61.67 v87.03,61.67
  Bottom 0.203: v87.03,61.67 91.6,66.4 95.25,66.45 104.05,66.45 104.4,66.8 105.7,66.8 108,64 109.6,64 111,65.4 143.4,65.4 148.2,70.2 148.2,72.2 148.67,72.67 149.62,72.67 151.04,74.09 152.11,74.09 J2.B7
N$1  (via drill 0.33)
  Top 0.305: U1.10 135.8,20.3 v134.4,21.7 | R5.2 v131.8,21.3
  Bottom 0.305: v131.8,21.3 134,21.3 v134.4,21.7
N$4  (via drill 0.33)
  Top 0.305: U1.9 136.3,21 v135.6,21.7 | v130.8,16.3 R6.2
  Bottom 0.305: v135.6,21.7 135.8,21.5 135.8,21.3 v130.8,16.3
N$5  (via drill 0.91 pad 1.6)
  other vias: 69.85,79.21
N$6  (via drill 0.33)
  Top 0.305: U1.1 135.8,15.1 v134.4,13.7 134,14.1 R11.1
N$7  (via drill 0.33)
  Top 0.305: U2.10 135.8,41.7 v134.4,43.1 | v131.8,42.7 R12.2
  Bottom 0.305: v134.4,43.1 134,42.7 v131.8,42.7
N$8  (via drill 0.33)
  Top 0.305: U2.9 136.3,42.4 v135.6,43.1 | v130.8,37.7 R13.2
  Bottom 0.305: v135.6,43.1 135.8,42.9 135.8,42.7 v130.8,37.7
N$9  (via drill 0.33)
  Top 0.305: U2.1 135.8,36.5 v134.4,35.1 134,35.5 R14.1
N$10  (via drill 0.91 pad 1.6)
  other vias: 69.85,81.75
N$11  (via drill 0.91 pad 1.6)
  other vias: 69.85,84.29
N$12  (via drill 0.91 pad 1.6)
  other vias: 69.85,86.83
N$13  (via drill 0.91 pad 1.6)
  other vias: 69.85,89.37
N$14  (via drill 0.91 pad 1.6)
  other vias: 69.85,91.91
N$16  (via drill 0.91 pad 1.6)
  other vias: 57.15,79.21
N$19  (via drill 0.91 pad 1.6)
  other vias: 59.69,79.21
N$21  (via drill 0.91 pad 1.6)
  other vias: 59.69,81.75
N$22  (via drill 0.91 pad 1.6)
  other vias: 57.15,81.75
N$23  (via drill 0.91 pad 1.6)
  other vias: 62.23,79.21
N$25  (via drill 0.91 pad 1.6)
  other vias: 62.23,81.75
N$26  (via drill 0.33)
  Top 0.203: 51.6,60.4 51.6,65.8 52.4,66.6 v52.4,68
N$27  (via drill 0.33)
  Top 0.203: 52,60.4 52,65.4 53.2,66.6 v53.2,67.2
N$29  (via drill 0.33)
  Top 0.203: 52.4,60.4 52.4,65 54,66.6 v54,68
N$31  (via drill 0.33)
  Top 0.203: 52.8,60.4 52.8,64.6 54.8,66.6 v54.8,67.2
N$36  (via drill 0.33)
  Top 0.203: 49.6,60.2 49.6,65.4 48.4,66.6 v48.4,67.2
N$39  (via drill 0.91 pad 1.6)
  other vias: 62.23,84.29
N$40  (via drill 0.91 pad 1.6)
  other vias: 59.69,84.29
N$44  (via drill 0.91 pad 1.6)
  other vias: 57.15,84.29
N$45  (via drill 0.91 pad 1.6)
  other vias: 57.15,86.83
N$46  (via drill 0.33)
  Top 0.203: 44.2,57.6 41.8,57.6 38.2,61.2 v37.6,61.2
N$47  (via drill 0.91 pad 1.6)
  other vias: 59.69,86.83
N$49  (via drill 0.91 pad 1.6)
  other vias: 62.23,86.83
N$50  (via drill 0.91 pad 1.6)
  other vias: 64.77,79.21
N$51  (via drill 0.91 pad 1.6)
  other vias: 64.77,81.75
N$52  (via drill 0.91 pad 1.6)
  other vias: 64.77,84.29
N$53  (via drill 0.91 pad 1.6)
  other vias: 64.77,86.83
N$54  (via drill 0.91 pad 1.6)
  other vias: 64.77,89.37
N$55  (via drill 0.91 pad 1.6)
  other vias: 62.23,89.37
N$56  (via drill 0.91 pad 1.6)
  other vias: 59.69,89.37
N$57  (via drill 0.91 pad 1.6)
  other vias: 57.15,89.37
N$58  (via drill 0.91 pad 1.6)
  other vias: 67.31,79.21
N$59  (via drill 0.33)
  Top 0.203: 57.6,54.4 63,54.4 63.4,54.8 v64,54.8
N$60  (via drill 0.33)
  Top 0.203: 57.6,54.8 62.6,54.8 63.4,55.6 v64.8,55.6
N$62  (via drill 0.33)
  Top 0.203: 44.2,57.2 41.4,57.2 38.2,60.4 v36.8,60.4
N$63  (via drill 0.33)
  Top 0.203: 57.6,56 61.4,56 63.4,58 v64,58
N$64  (via drill 0.33)
  Top 0.203: 57.6,56.4 61,56.4 63.4,58.8 v64.8,58.8
N$65  (via drill 0.33)
  Top 0.203: 44.2,54.4 38.6,54.4 38.2,54.8 v37.6,54.8
N$66  (via drill 0.33)
  Top 0.203: v36.8,54 44.2,54
N$68  (via drill 0.33)
  Top 0.203: 49.2,60.4 49.2,65 47.6,66.6 v47.6,68
N$71  (via drill 0.33)
  Top 0.203: 48,60.4 48,63.8 45.2,66.6 v45.2,67.2
N$72  (via drill 0.33)
  Top 0.203: 47.6,60.4 47.6,63.4 44.4,66.6 v44.4,68
N$73  (via drill 0.33)
  Top 0.203: 44.2,53.6 38.6,53.6 38.2,53.2 v37.6,53.2
N$74  (via drill 0.33)
  Top 0.203: 46.8,60.4 46.8,62.6 42.8,66.6 v42.8,68
N$75  (via drill 0.33)
  Top 0.203: 46.4,60.6 46.4,62.2 42,66.6 v42,67.2
N$76  (via drill 0.33)
  Top 0.203: 44.2,53.2 39,53.2 38.2,52.4 v36.8,52.4
N$77  (via drill 0.33)
  Top 0.203: 44.2,52.8 39.4,52.8 38.2,51.6 v37.6,51.6
N$78  (via drill 0.33)
  Top 0.203: 44.2,52.4 39.8,52.4 38.2,50.8 v36.8,50.8
N$80  (via drill 0.33)
  Top 0.203: 44.2,51.2 41,51.2 38.2,48.4 v37.6,48.4
N$81  (via drill 0.33)
  Top 0.203: 44.2,50.8 41.4,50.8 38.2,47.6 v36.8,47.6
N$82  (via drill 0.33)
  Top 0.203: 44.2,50.4 41.8,50.4 38.2,46.8 v37.6,46.8
N$84  (via drill 0.33)
  Top 0.203: 57.4,50.4 59.8,50.4 63.4,46.8 v64,46.8
N$85  (via drill 0.33)
  Top 0.203: v64.8,46 63.4,46 59.4,50 57.4,50
N$88  (via drill 0.33)
  Top 0.203: v64.8,54 57.6,54
N$93  (via drill 0.33)
  Top 0.203: 52,47.4 52,42.4 53.2,41.2 v53.2,40.6
N$98  (via drill 0.91 pad 1.6)
  other vias: 115.57,81.75
N$99  (via drill 0.91 pad 1.6)
  other vias: 118.11,81.75
N$100  (via drill 0.91 pad 1.6)
  other vias: 120.65,81.75
N$101  (via drill 0.91 pad 1.6)
  other vias: 120.65,84.29
N$102  (via drill 0.91 pad 1.6)
  other vias: 118.11,84.29
N$103  (via drill 0.91 pad 1.6)
  other vias: 67.31,81.75
N$104  (via drill 0.91 pad 1.6)
  other vias: 67.31,84.29
N$105  (via drill 0.91 pad 1.6)
  other vias: 67.31,86.83
N$106  (via drill 0.91 pad 1.6)
  other vias: 67.31,89.37
N$107  (via drill 0.91 pad 1.6)
  other vias: 67.31,91.91
N$108  (via drill 0.91 pad 1.6)
  other vias: 64.77,91.91
N$109  (via drill 0.91 pad 1.6)
  other vias: 62.23,91.91
N$110  (via drill 0.91 pad 1.6)
  other vias: 59.69,91.91
N$112  (via drill 0.91 pad 1.6)
  other vias: 115.57,84.29
N$115  (via drill 0.91 pad 1.6)
  other vias: 69.85,74.13
N$116  (via drill 0.91 pad 1.6)
  other vias: 69.85,76.67
N$117  (via drill 0.91 pad 1.6)
  other vias: 62.23,74.13
N$119  (via drill 0.91 pad 1.6)
  other vias: 59.69,74.13
N$120  (via drill 0.91 pad 1.6)
  other vias: 57.15,74.13
N$121  (via drill 0.91 pad 1.6)
  other vias: 57.15,76.67
N$122  (via drill 0.91 pad 1.6)
  other vias: 59.69,76.67
N$123  (via drill 0.91 pad 1.6)
  other vias: 62.23,76.67
N$124  (via drill 0.91 pad 1.6)
  other vias: 64.77,74.13
N$125  (via drill 0.91 pad 1.6)
  other vias: 64.77,76.67
N$126  (via drill 0.91 pad 1.6)
  other vias: 67.31,74.13
N$127  (via drill 0.91 pad 1.6)
  other vias: 67.31,76.67
N$128  (via drill 0.91 pad 1.6)
  other vias: 123.19,84.29
N$129  (via drill 0.91 pad 1.6)
  other vias: 123.19,86.83
N$130  (via drill 0.91 pad 1.6)
  other vias: 120.65,86.83
N$131  (via drill 0.91 pad 1.6)
  other vias: 118.11,86.83
N$132  (via drill 0.91 pad 1.6)
  other vias: 115.57,86.83
N$133  (via drill 0.91 pad 1.6)
  other vias: 115.57,89.37
N$134  (via drill 0.91 pad 1.6)
  other vias: 118.11,89.37
N$135  (via drill 0.91 pad 1.6)
  other vias: 120.65,89.37
N$136  (via drill 0.91 pad 1.6)
  other vias: 123.19,89.37
N$139  (via drill 0.91 pad 1.6)
  other vias: 125.73,84.29
N$140  (via drill 0.91 pad 1.6)
  other vias: 125.73,86.83
N$141  (via drill 0.91 pad 1.6)
  other vias: 125.73,89.37
N$142  (via drill 0.91 pad 1.6)
  other vias: 125.73,91.91
N$143  (via drill 0.91 pad 1.6)
  other vias: 123.19,91.91
N$144  (via drill 0.91 pad 1.6)
  other vias: 120.65,91.91
N$145  (via drill 0.91 pad 1.6)
  other vias: 118.11,91.91
N$146  (via drill 0.91 pad 1.6)
  other vias: 115.57,91.91
N$169
  Bottom 0.406: 57.15,89.37 59.69,89.37
N$173
  Bottom 0.406: 72.39,86.83 74.93,86.83
N$174  (via drill 0.91 pad 1.6)
  other vias: 85.09,76.67
N$175  (via drill 0.91 pad 1.6)
  other vias: 85.09,79.21
N$176
  Bottom 0.406: 77.47,86.83 80.01,86.83
N$178  (via drill 0.91 pad 1.6)
  other vias: 125.73,94.45
N$179  (via drill 0.91 pad 1.6)
  other vias: 123.19,94.45
N$180  (via drill 0.91 pad 1.6)
  other vias: 120.65,94.45
N$181  (via drill 0.91 pad 1.6)
  other vias: 118.11,94.45
N$182  (via drill 0.91 pad 1.6)
  other vias: 115.57,94.45
N$183
  Bottom 0.406: 82.55,86.83 85.09,86.83
N$184
  Bottom 0.406: 87.63,86.83 90.17,86.83
N$185
  Bottom 0.406: 72.39,89.37 74.93,89.37
N$188
  Bottom 0.406: 77.47,89.37 80.01,89.37
N$189  (via drill 0.33)
  Top 0.203: v64.8,62 63.4,62 59.4,58 57.6,58
N$190
  Bottom 0.406: 82.55,89.37 85.09,89.37
N$191
  Bottom 0.406: 87.63,89.37 90.17,89.37
N$192  (via drill 0.91 pad 1.6)
  other vias: 77.47,76.67
N$193  (via drill 0.91 pad 1.6)
  other vias: 74.93,76.67
N$194  (via drill 0.91 pad 1.6)
  other vias: 72.39,76.67
N$195  (via drill 0.91 pad 1.6)
  other vias: 72.39,79.21
N$196  (via drill 0.91 pad 1.6)
  other vias: 74.93,79.21
N$197  (via drill 0.91 pad 1.6)
  other vias: 77.47,79.21
N$198
  Bottom 0.406: 72.39,91.91 74.93,91.91
N$199  (via drill 0.91 pad 1.6)
  other vias: 80.01,76.67
N$200  (via drill 0.91 pad 1.6)
  other vias: 80.01,79.21
N$201  (via drill 0.91 pad 1.6)
  other vias: 72.39,74.18
N$202  (via drill 0.91 pad 1.6)
  other vias: 82.55,76.67
N$203  (via drill 0.91 pad 1.6)
  other vias: 82.55,79.21
N$206  (via drill 0.91 pad 1.6)
  other vias: 100.33,79.21
N$211  (via drill 0.91 pad 1.6)
  other vias: 90.17,76.67
N$212  (via drill 0.91 pad 1.6)
  other vias: 87.63,76.67
N$213  (via drill 0.91 pad 1.6)
  other vias: 87.63,79.21
N$214  (via drill 0.91 pad 1.6)
  other vias: 90.17,79.21
N$215  (via drill 0.91 pad 1.6)
  other vias: 92.71,79.21
N$218  (via drill 0.91 pad 1.6)
  other vias: 95.25,79.21
N$221  (via drill 0.91 pad 1.6)
  other vias: 97.79,79.21
N$223  (via drill 0.91 pad 1.6)
  other vias: 105.41,79.21
N$224  (via drill 0.91 pad 1.6)
  other vias: 102.87,79.21
N$234
  Bottom 0.406: 77.47,91.91 80.01,91.91
N$235
  Bottom 0.406: 82.55,91.91 85.09,91.91
N$236
  Bottom 0.406: 87.63,91.91 90.17,91.91
N$237  (via drill 0.91 pad 1.6)
  other vias: 74.93,74.18
N$238  (via drill 0.91 pad 1.6)
  other vias: 97.79,74.18
N$239
  Bottom 0.406: 72.39,94.45 74.93,94.45
N$250
  Bottom 0.406: 77.47,94.45 80.01,94.45
N$259
  Bottom 0.406: 82.55,94.45 85.09,94.45
N$262
  Bottom 0.406: 87.63,94.45 90.17,94.45
N$268  (via drill 0.91 pad 1.6)
  other vias: 85.09,81.75
N$269  (via drill 0.91 pad 1.6)
  other vias: 87.63,81.75
N$270  (via drill 0.91 pad 1.6)
  other vias: 90.17,81.75
N$271  (via drill 0.91 pad 1.6)
  other vias: 90.17,84.29
N$272  (via drill 0.91 pad 1.6)
  other vias: 87.63,84.29
N$273  (via drill 0.91 pad 1.6)
  other vias: 85.09,84.29
N$274  (via drill 0.91 pad 1.6)
  other vias: 92.71,81.75
N$275  (via drill 0.91 pad 1.6)
  other vias: 92.71,84.29
N$276  (via drill 0.91 pad 1.6)
  other vias: 92.71,86.83
N$277  (via drill 0.91 pad 1.6)
  other vias: 90.17,86.83
N$278  (via drill 0.91 pad 1.6)
  other vias: 87.63,86.83
N$279  (via drill 0.91 pad 1.6)
  other vias: 85.09,86.83
N$280  (via drill 0.91 pad 1.6)
  other vias: 85.09,89.37
N$281  (via drill 0.91 pad 1.6)
  other vias: 87.63,89.37
N$282  (via drill 0.91 pad 1.6)
  other vias: 90.17,89.37
N$283  (via drill 0.91 pad 1.6)
  other vias: 92.71,89.37
N$284  (via drill 0.91 pad 1.6)
  other vias: 95.25,81.75
N$285  (via drill 0.91 pad 1.6)
  other vias: 95.25,84.29
N$286  (via drill 0.91 pad 1.6)
  other vias: 95.25,86.83
N$287  (via drill 0.91 pad 1.6)
  other vias: 95.25,89.37
N$288  (via drill 0.91 pad 1.6)
  other vias: 95.25,91.91
N$289  (via drill 0.91 pad 1.6)
  other vias: 92.71,91.91
N$290  (via drill 0.91 pad 1.6)
  other vias: 90.17,91.91
N$291  (via drill 0.91 pad 1.6)
  other vias: 87.63,91.91
N$292  (via drill 0.91 pad 1.6)
  other vias: 85.09,91.91
N$293  (via drill 0.91 pad 1.6)
  other vias: 97.79,81.75
N$294  (via drill 0.91 pad 1.6)
  other vias: 97.79,84.29
N$295  (via drill 0.91 pad 1.6)
  other vias: 97.79,86.83
N$296  (via drill 0.91 pad 1.6)
  other vias: 97.79,89.37
N$297  (via drill 0.91 pad 1.6)
  other vias: 97.79,91.91
N$298  (via drill 0.91 pad 1.6)
  other vias: 97.79,94.45
N$299  (via drill 0.91 pad 1.6)
  other vias: 95.25,94.45
N$300  (via drill 0.91 pad 1.6)
  other vias: 92.71,94.45
N$301  (via drill 0.91 pad 1.6)
  other vias: 90.17,94.45
N$302  (via drill 0.91 pad 1.6)
  other vias: 87.63,94.45
N$303  (via drill 0.91 pad 1.6)
  other vias: 85.09,94.45
N$304  (via drill 0.91 pad 1.6)
  other vias: 100.33,81.75
N$305  (via drill 0.91 pad 1.6)
  other vias: 102.87,81.75
N$306  (via drill 0.91 pad 1.6)
  other vias: 105.41,81.75
N$307  (via drill 0.91 pad 1.6)
  other vias: 105.41,84.29
N$308  (via drill 0.91 pad 1.6)
  other vias: 102.87,84.29
N$309  (via drill 0.91 pad 1.6)
  other vias: 100.33,84.29
N$310  (via drill 0.91 pad 1.6)
  other vias: 107.95,81.75
N$311  (via drill 0.91 pad 1.6)
  other vias: 107.95,84.29
N$312  (via drill 0.91 pad 1.6)
  other vias: 107.95,86.83
N$313  (via drill 0.91 pad 1.6)
  other vias: 105.41,86.83
N$314  (via drill 0.91 pad 1.6)
  other vias: 102.87,86.83
N$315  (via drill 0.91 pad 1.6)
  other vias: 100.33,86.83
N$316  (via drill 0.91 pad 1.6)
  other vias: 100.33,89.37
N$317  (via drill 0.91 pad 1.6)
  other vias: 102.87,89.37
N$318  (via drill 0.91 pad 1.6)
  other vias: 105.41,89.37
N$319  (via drill 0.91 pad 1.6)
  other vias: 107.95,89.37
N$320  (via drill 0.91 pad 1.6)
  other vias: 110.49,81.75
N$321  (via drill 0.91 pad 1.6)
  other vias: 110.49,84.29
N$322  (via drill 0.91 pad 1.6)
  other vias: 110.49,86.83
N$323  (via drill 0.91 pad 1.6)
  other vias: 110.49,89.37
N$324  (via drill 0.91 pad 1.6)
  other vias: 110.49,91.91
N$325  (via drill 0.91 pad 1.6)
  other vias: 107.95,91.91
N$326  (via drill 0.91 pad 1.6)
  other vias: 105.41,91.91
N$327  (via drill 0.91 pad 1.6)
  other vias: 102.87,91.91
N$328  (via drill 0.91 pad 1.6)
  other vias: 100.33,91.91
N$329  (via drill 0.91 pad 1.6)
  other vias: 113.03,81.75
N$330  (via drill 0.91 pad 1.6)
  other vias: 113.03,84.29
N$331  (via drill 0.91 pad 1.6)
  other vias: 113.03,86.83
N$332  (via drill 0.91 pad 1.6)
  other vias: 113.03,89.37
N$333  (via drill 0.91 pad 1.6)
  other vias: 113.03,91.91
N$334  (via drill 0.91 pad 1.6)
  other vias: 113.03,94.45
N$335  (via drill 0.91 pad 1.6)
  other vias: 110.49,94.45
N$336  (via drill 0.91 pad 1.6)
  other vias: 107.95,94.45
N$337  (via drill 0.91 pad 1.6)
  other vias: 105.41,94.45
N$338  (via drill 0.91 pad 1.6)
  other vias: 102.87,94.45
N$339  (via drill 0.91 pad 1.6)
  other vias: 100.33,94.45
N$340  (via drill 0.91 pad 1.6)
  other vias: 110.49,76.72
N$341  (via drill 0.91 pad 1.6)
  other vias: 72.39,81.75
N$342  (via drill 0.91 pad 1.6)
  other vias: 74.93,81.75
N$343  (via drill 0.91 pad 1.6)
  other vias: 74.93,84.29
N$344  (via drill 0.91 pad 1.6)
  other vias: 72.39,84.29
N$345  (via drill 0.91 pad 1.6)
  other vias: 113.03,76.72
N$346  (via drill 0.91 pad 1.6)
  other vias: 77.47,81.75
N$347  (via drill 0.91 pad 1.6)
  other vias: 77.47,84.29
N$348  (via drill 0.91 pad 1.6)
  other vias: 77.47,86.83
N$349  (via drill 0.91 pad 1.6)
  other vias: 74.93,86.83
N$350  (via drill 0.91 pad 1.6)
  other vias: 72.39,86.83
N$351  (via drill 0.91 pad 1.6)
  other vias: 115.57,76.72
N$352  (via drill 0.91 pad 1.6)
  other vias: 115.57,79.26
N$353  (via drill 0.91 pad 1.6)
  other vias: 72.39,89.37
N$354  (via drill 0.91 pad 1.6)
  other vias: 74.93,89.37
N$355  (via drill 0.91 pad 1.6)
  other vias: 77.47,89.37
N$356  (via drill 0.91 pad 1.6)
  other vias: 80.01,81.75
N$357  (via drill 0.91 pad 1.6)
  other vias: 80.01,84.29
N$358  (via drill 0.91 pad 1.6)
  other vias: 80.01,86.83
N$359  (via drill 0.91 pad 1.6)
  other vias: 80.01,89.37
N$360  (via drill 0.91 pad 1.6)
  other vias: 80.01,91.91
N$361  (via drill 0.91 pad 1.6)
  other vias: 77.47,91.91
N$362  (via drill 0.91 pad 1.6)
  other vias: 74.93,91.91
N$363  (via drill 0.91 pad 1.6)
  other vias: 72.39,91.91
N$364  (via drill 0.91 pad 1.6)
  other vias: 113.03,79.26
N$365  (via drill 0.91 pad 1.6)
  other vias: 82.55,81.75
N$366  (via drill 0.91 pad 1.6)
  other vias: 82.55,84.29
N$367  (via drill 0.91 pad 1.6)
  other vias: 82.55,86.83
N$368  (via drill 0.91 pad 1.6)
  other vias: 82.55,89.37
N$369  (via drill 0.91 pad 1.6)
  other vias: 82.55,91.91
N$370  (via drill 0.91 pad 1.6)
  other vias: 82.55,94.45
N$371  (via drill 0.91 pad 1.6)
  other vias: 80.01,94.45
N$372  (via drill 0.91 pad 1.6)
  other vias: 77.47,94.45
N$373  (via drill 0.91 pad 1.6)
  other vias: 74.93,94.45
N$374  (via drill 0.91 pad 1.6)
  other vias: 72.39,94.45
N$375  (via drill 0.91 pad 1.6)
  other vias: 110.49,79.26
N$376  (via drill 0.91 pad 1.6)
  other vias: 125.73,76.72
N$381  (via drill 0.91 pad 1.6)
  other vias: 125.73,79.26
N$387  (via drill 0.91 pad 1.6)
  other vias: 125.73,81.8
N$388
  Bottom 0.406: 92.71,86.83 95.25,86.83
N$389
  Bottom 0.406: 97.79,86.83 100.33,86.83
N$390
  Bottom 0.406: 102.87,86.83 105.41,86.83
N$397
  Bottom 0.406: 107.95,86.83 110.49,86.83
N$398
  Bottom 0.406: 92.71,89.37 95.25,89.37
N$399
  Bottom 0.406: 97.79,89.37 100.33,89.37
N$400
  Bottom 0.406: 102.87,89.37 105.41,89.37
N$408
  Bottom 0.406: 107.95,89.37 110.49,89.37
N$409
  Bottom 0.406: 92.71,91.91 95.25,91.91
N$410
  Bottom 0.406: 97.79,91.91 100.33,91.91
N$411
  Bottom 0.406: 102.87,91.91 105.41,91.91
N$412  (via drill 0.91 pad 1.6)
  other vias: 118.11,76.72
N$413  (via drill 0.91 pad 1.6)
  other vias: 118.11,79.26
N$414  (via drill 0.91 pad 1.6)
  other vias: 102.87,76.72
N$415  (via drill 0.91 pad 1.6)
  other vias: 100.33,76.72
N$416  (via drill 0.91 pad 1.6)
  other vias: 97.79,76.72
N$417  (via drill 0.91 pad 1.6)
  other vias: 95.25,76.72
N$418
  Bottom 0.406: 107.95,91.91 110.49,91.91
N$419
  Bottom 0.406: 92.71,94.45 95.25,94.45
N$420
  Bottom 0.406: 97.79,94.45 100.33,94.45
N$421
  Bottom 0.406: 102.87,94.45 105.41,94.45
N$422  (via drill 0.91 pad 1.6)
  other vias: 120.65,76.72
N$423  (via drill 0.91 pad 1.6)
  other vias: 120.65,79.26
N$424  (via drill 0.91 pad 1.6)
  other vias: 105.41,76.72
N$425
  Bottom 0.406: 107.95,94.45 110.49,94.45
N$426
  Bottom 0.406: 113.03,86.83 115.57,86.83
N$427
  Bottom 0.406: 118.11,86.83 120.65,86.83
N$428
  Bottom 0.406: 123.19,86.83 125.73,86.83
N$430
  Bottom 0.406: 113.03,89.37 115.57,89.37
N$431  (via drill 0.91 pad 1.6)
  other vias: 123.19,76.72
N$432  (via drill 0.91 pad 1.6)
  other vias: 123.19,79.26
N$433  (via drill 0.91 pad 1.6)
  other vias: 123.19,81.8
N$434
  Bottom 0.406: 118.11,89.37 120.65,89.37
N$435
  Bottom 0.406: 123.19,89.37 125.73,89.37
N$437
  Bottom 0.406: 113.03,91.91 115.57,91.91
N$438
  Bottom 0.406: 118.11,91.91 120.65,91.91
N$439
  Bottom 0.406: 123.19,91.91 125.73,91.91
N$441
  Bottom 0.406: 113.03,94.45 115.57,94.45
N$442
  Bottom 0.406: 118.11,94.45 120.65,94.45
N$443
  Bottom 0.406: 123.19,94.45 125.73,94.45
N$446
  Bottom 0.406: 123.19,76.67 125.73,76.67
N$453
  Bottom 0.406: 123.19,79.21 125.73,79.21
N$457
  Bottom 0.406: 123.19,81.75 125.73,81.75
N$462
  Bottom 0.406: 123.19,84.29 125.73,84.29
N$466
  Bottom 0.406: 102.87,76.67 105.41,76.67
N$467  (via drill 0.91 pad 1.6)
  other vias: 107.95,76.72
N$468  (via drill 0.91 pad 1.6)
  other vias: 107.95,79.26
N$469  (via drill 0.91 pad 1.6)
  other vias: 92.71,76.72
N$470
  Bottom 0.406: 107.95,76.67 110.49,76.67
N$471
  Bottom 0.406: 113.03,76.67 115.57,76.67
N$472
  Bottom 0.406: 118.11,76.67 120.65,76.67
N$473
  Bottom 0.406: 102.87,79.21 105.41,79.21
N$474
  Bottom 0.406: 107.95,79.21 110.49,79.21
N$475
  Bottom 0.406: 113.03,79.21 115.57,79.21
N$476
  Bottom 0.406: 118.11,79.21 120.65,79.21
N$477
  Bottom 0.406: 102.87,81.75 105.41,81.75
N$478  (via drill 0.91 pad 1.6)
  other vias: 82.55,74.18
N$479  (via drill 0.91 pad 1.6)
  other vias: 85.09,74.18
N$480  (via drill 0.91 pad 1.6)
  other vias: 87.63,74.18
N$481  (via drill 0.91 pad 1.6)
  other vias: 110.49,74.18
N$482  (via drill 0.91 pad 1.6)
  other vias: 107.95,74.18
N$483  (via drill 0.91 pad 1.6)
  other vias: 105.41,74.18
N$484  (via drill 0.91 pad 1.6)
  other vias: 90.17,74.18
N$485  (via drill 0.91 pad 1.6)
  other vias: 113.03,74.18
N$489  (via drill 0.91 pad 1.6)
  other vias: 125.73,74.18
N$490
  Bottom 0.406: 107.95,81.75 110.49,81.75
N$491
  Bottom 0.406: 113.03,81.75 115.57,81.75
N$494  (via drill 0.91 pad 1.6)
  other vias: 92.71,74.18
N$495  (via drill 0.91 pad 1.6)
  other vias: 115.57,74.18
N$497
  Bottom 0.406: 118.11,81.75 120.65,81.75
N$498
  Bottom 0.406: 102.87,84.29 105.41,84.29
N$499
  Bottom 0.406: 107.95,84.29 110.49,84.29
N$501
  Bottom 0.406: 113.03,84.29 115.57,84.29
N$502
  Bottom 0.406: 118.11,84.29 120.65,84.29
N$503  (via drill 0.91 pad 1.6)
  other vias: 95.25,74.18
N$504  (via drill 0.91 pad 1.6)
  other vias: 118.11,74.18
N$506
  Bottom 0.406: 82.55,76.67 85.09,76.67
N$507
  Bottom 0.406: 87.63,76.67 90.17,76.67
N$508
  Bottom 0.406: 92.71,76.67 95.25,76.67
N$509
  Bottom 0.406: 97.79,76.67 100.33,76.67
N$510
  Bottom 0.406: 82.55,79.21 85.09,79.21
N$511
  Bottom 0.406: 87.63,79.21 90.17,79.21
N$512
  Bottom 0.406: 92.71,79.21 95.25,79.21
N$513
  Bottom 0.406: 97.79,79.21 100.33,79.21
N$514
  Bottom 0.406: 82.55,81.75 85.09,81.75
N$515
  Bottom 0.406: 87.63,81.75 90.17,81.75
N$516
  Bottom 0.406: 92.71,81.75 95.25,81.75
N$517
  Bottom 0.406: 97.79,81.75 100.33,81.75
N$518
  Bottom 0.406: 82.55,84.29 85.09,84.29
N$519  (via drill 0.91 pad 1.6)
  other vias: 77.47,74.18
N$520  (via drill 0.91 pad 1.6)
  other vias: 100.33,74.18
N$521  (via drill 0.91 pad 1.6)
  other vias: 120.65,74.18
N$522
  Bottom 0.406: 87.63,84.29 90.17,84.29
N$523
  Bottom 0.406: 92.71,84.29 95.25,84.29
N$524
  Bottom 0.406: 97.79,84.29 100.33,84.29
N$525
  Bottom 0.406: 62.23,76.67 64.77,76.67
N$526
  Bottom 0.406: 67.31,76.67 69.85,76.67
N$527
  Bottom 0.406: 72.39,76.67 74.93,76.67
N$528  (via drill 0.91 pad 1.6)
  other vias: 80.01,74.18
N$529  (via drill 0.91 pad 1.6)
  other vias: 102.87,74.18
N$530  (via drill 0.91 pad 1.6)
  other vias: 123.19,74.18
N$531
  Bottom 0.406: 77.47,76.67 80.01,76.67
N$532
  Bottom 0.406: 62.23,79.21 64.77,79.21
N$533
  Bottom 0.406: 67.31,79.21 69.85,79.21
N$534
  Bottom 0.406: 72.39,79.21 74.93,79.21
N$535
  Bottom 0.406: 77.47,79.21 80.01,79.21
N$536
  Bottom 0.406: 62.23,81.75 64.77,81.75
N$537
  Bottom 0.406: 67.31,81.75 69.85,81.75
N$538
  Bottom 0.406: 72.39,81.75 74.93,81.75
N$539
  Bottom 0.406: 77.47,81.75 80.01,81.75
N$540
  Bottom 0.406: 62.23,84.29 64.77,84.29
N$541
  Bottom 0.406: 67.31,84.29 69.85,84.29
N$542
  Bottom 0.406: 72.39,84.29 74.93,84.29
N$543
  Bottom 0.406: 77.47,84.29 80.01,84.29
N$544
  Bottom 0.406: 62.23,91.91 64.77,91.91
N$545
  Bottom 0.406: 67.31,91.91 69.85,91.91
N$546
  Bottom 0.406: 62.23,89.37 64.77,89.37
N$547
  Bottom 0.406: 67.31,89.37 69.85,89.37
N$548
  Bottom 0.406: 62.23,86.83 64.77,86.83
N$549
  Bottom 0.406: 67.31,86.83 69.85,86.83
N$550
  Bottom 0.406: 62.23,74.13 64.77,74.13
N$551
  Bottom 0.406: 67.31,74.13 69.85,74.13
N$552
  Bottom 0.406: 72.39,74.13 74.93,74.13
N$553
  Bottom 0.406: 77.47,74.13 80.01,74.13
N$554
  Bottom 0.406: 82.55,74.13 85.09,74.13
N$555
  Bottom 0.406: 87.63,74.13 90.17,74.13
N$556
  Bottom 0.406: 92.71,74.13 95.25,74.13
N$557
  Bottom 0.406: 97.79,74.13 100.33,74.13
N$558
  Bottom 0.406: 102.87,74.13 105.41,74.13
N$559
  Bottom 0.406: 107.95,74.13 110.49,74.13
N$560
  Bottom 0.406: 113.03,74.13 115.57,74.13
N$561
  Bottom 0.406: 118.11,74.13 120.65,74.13
N$562
  Bottom 0.406: 123.19,74.13 125.73,74.13
N$574
  Bottom 0.406: 57.15,86.83 59.69,86.83
N$575
  Bottom 0.406: 57.15,84.29 59.69,84.29
N$576
  Bottom 0.406: 57.15,81.75 59.69,81.75
N$577
  Bottom 0.406: 57.15,79.21 59.69,79.21
N$578
  Bottom 0.406: 57.15,76.67 59.69,76.67
N$579
  Bottom 0.406: 57.15,74.13 59.69,74.13
OSC1  (via drill 0.33)
  Top 0.203: IC1.63 v50.8,68 | v62.87,67.06 Y1.3
  Bottom 0.203: v50.8,68 50.8,65.6 51.66,64.74 51.7,64.77 60.58,64.77 v62.87,67.06
OSC2  (via drill 0.33)
  Top 0.203: IC1.64 50.4,66.2 50,66.6 v50,67.2
PBUS0  (via drill 0.33)
  Top 0.203: PIC16.16 52.98,24.42 v50.2,27.2 | v47.6,29.6 33.8,43.6 33.8,47.6 36.2,50 v37.6,50 38.2,50 40.2,52 IC1.93
  Bottom 0.203: v50.2,27.2 v47.6,29.6
PBUS1  (via drill 0.33)
  Top 0.203: IC1.94 40.6,51.6 38.2,49.2 v36.8,49.2 36.8,49.11 35.74,48.04 35.74,43.78 55.47,24.04 55.47,20.66 PIC16.15
PBUS2  (via drill 0.33)
  Top 0.203: IC1.98 42.2,50 38.2,46 v36.8,46 36.8,45.91 36.09,45.2 36.09,43.95 58.05,22 58.05,20.66 PIC16.14
PBUS3  (via drill 0.33)
  Top 0.203: IC1.99 42.6,49.6 38.2,45.2 v37.6,45.2 | v35.12,45.29 35.12,43.87 48.9,30.09 48.9,20.13 51.38,17.64 51.38,12.57 52.54,11.42 55.92,11.42 57.43,12.93 58.05,12.93 PIC16.7
  Bottom 0.203: v35.12,45.29 37.52,45.29 v37.6,45.2
PBUS4  (via drill 0.33)
  Top 0.203: IC1.100 43,49.2 38.2,44.4 v36.8,44.4
  Bottom 0.203: PIC16.6 55.56,12.93 56.1,12.93 57.96,11.06 66.23,11.06 67.03,11.86 67.03,30.09 61.78,35.33 61.78,40.4 57.78,44.4 v36.8,44.4
PBUS5  (via drill 0.33)
  Top 0.203: IC1.3 46.8,45.2 42.8,41.2 v42.8,39.8 42.85,39.78 44.18,38.42 50.49,38.42 59.65,29.29 59.65,19.68 57.8,17.8 56.4,17.8 53.6,14.8 52.98,13.02 PIC16.5
PBUS6  (via drill 0.33)
  Top 0.203: IC1.4 47.2,44.8 43.6,41.2 v43.6,40.6